# Altium schematic sheet SENSE.SchDoc
size Letter; SheetNumber: 2; SheetTotal: 2
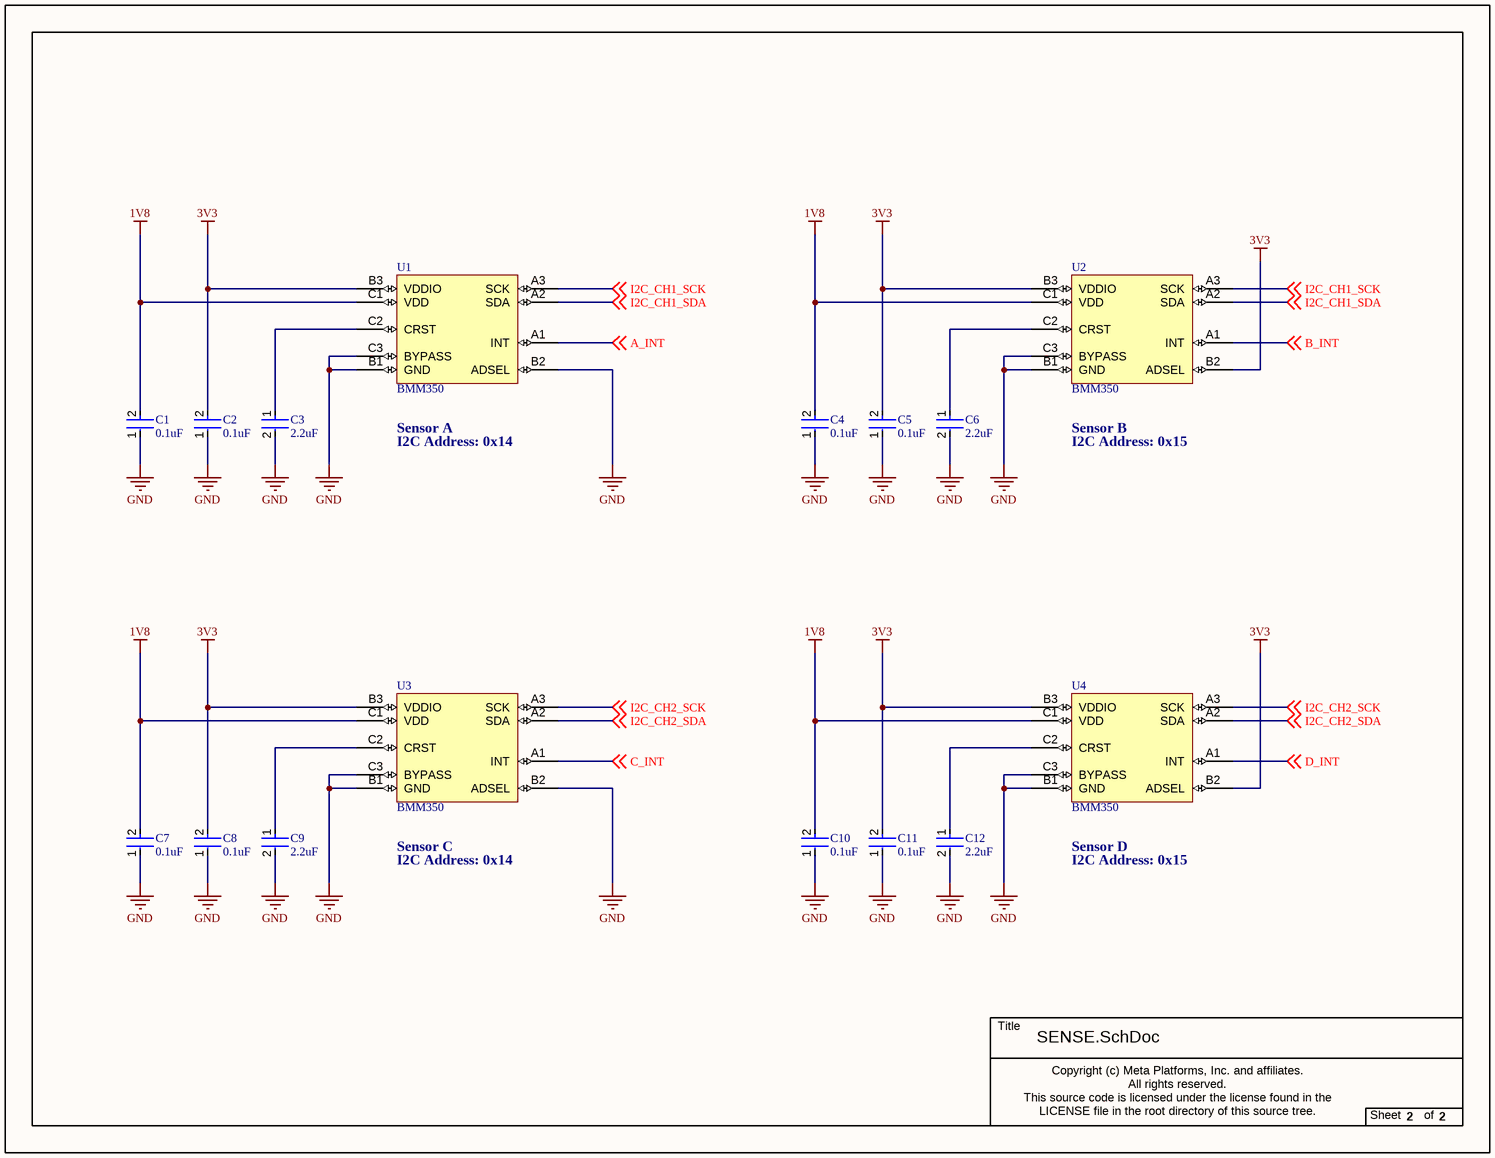
[diagram p0: SENSE.SchDoc]

## Parts
C1  0.1uF  [FP-GRM15-MFG]
C2  0.1uF  [FP-GRM15-MFG]
C3  2.2uF  [FP-C1005-050-0_15-0_1-MFG]
C4  0.1uF  [FP-GRM15-MFG]
C5  0.1uF  [FP-GRM15-MFG]
C6  2.2uF  [FP-C1005-050-0_15-0_1-MFG]
C7  0.1uF  [FP-GRM15-MFG]
C8  0.1uF  [FP-GRM15-MFG]
C9  2.2uF  [FP-C1005-050-0_15-0_1-MFG]
C10  0.1uF  [FP-GRM15-MFG]
C11  0.1uF  [FP-GRM15-MFG]
C12  2.2uF  [FP-C1005-050-0_15-0_1-MFG]
U1  BMM350  [BMM350]
U2  BMM350  [BMM350]
U3  BMM350  [BMM350]
U4  BMM350  [BMM350]

## Nets
1V8: C1.2 C4.2 C7.2 C10.2 U1.C1(VDD) U2.C1(VDD) U3.C1(VDD) U4.C1(VDD)
3V3: C2.2 C5.2 C8.2 C11.2 U1.B3(VDDIO) U2.B2(ADSEL) U2.B3(VDDIO) U3.B3(VDDIO) U4.B2(ADSEL) U4.B3(VDDIO)
GND: C1.1 C2.1 C3.2 C4.1 C5.1 C6.2 C7.1 C8.1 C9.2 C10.1 C11.1 C12.2 U1.B1(GND) U1.B2(ADSEL) U1.C3(BYPASS) U2.B1(GND) U2.C3(BYPASS) U3.B1(GND) U3.B2(ADSEL) U3.C3(BYPASS) U4.B1(GND) U4.C3(BYPASS)
A_INT: U1.A1(INT) ; off-sheet A_INT
B_INT: U2.A1(INT) ; off-sheet B_INT
C_INT: U3.A1(INT) ; off-sheet C_INT
D_INT: U4.A1(INT) ; off-sheet D_INT
I2C_CH1_SCK: U1.A3(SCK) U2.A3(SCK) ; off-sheet I2C_CH1_SCK
I2C_CH1_SDA: U1.A2(SDA) U2.A2(SDA) ; off-sheet I2C_CH1_SDA
I2C_CH2_SCK: U3.A3(SCK) U4.A3(SCK) ; off-sheet I2C_CH2_SCK
I2C_CH2_SDA: U3.A2(SDA) U4.A2(SDA) ; off-sheet I2C_CH2_SDA
NetC3_1: C3.1 U1.C2(CRST)
NetC6_1: C6.1 U2.C2(CRST)
NetC9_1: C9.1 U3.C2(CRST)
NetC12_1: C12.1 U4.C2(CRST)

## Notes on the sheet
- (near U1) Sensor A
- (near U2) Sensor B
- I2C Address: 0x14
- I2C Address: 0x15
- (near U3) Sensor C
- (near U4) Sensor D
- Title
- Copyright (c) Meta Platforms, Inc. and affiliates.
  All rights reserved.
  This source code is licensed under the license found in the
  LICENSE file in the root directory of this source tree.
- Sheet
- of

## Library data of the parts
C1 C2 C4 C5 C7 C8 C10 C11 = CMP-2100-03641-2: CAP CER 0.1UF 16V X7R 0402; Manufacturer Part Number: GRM155R71C104KA88D; Manufacturer: Murata; Standoff Height: 0mm; Tolerance: 10%; Voltage Rating: 16Vdc; Material: Ceramic; Capacitance: 0.10μF; Value: 0.10μF; RoHS: TRUE; Temperature Characteristic: X7R; Octopart: https://octopart.com/grm155r71c104ka88d-murata-196880; Digikey Description: CAP CER 0.1UF 16V X7R 0402; Device Class L3: Ceramic Capacitors; Height: 0.55mm; ComponentLink2Description: Datasheet; Temperature Range Low: -55°C; Ipc Land Pattern Name: CAPC10050X219; ComponentLink2URL: https://search.murata.co.jp/Ceramy/image/img/A01X/G101/ENG/GRM155R71H471KA01-01A.pdf; Device Class L1: Passive Components; Lead Free: yes; Category: Cap; Package: GRM15; Temperature: -55°C to +125°C; Device Class L2: Capacitors; Temperature Range High: +125°C; Mouser Description: 0402 0.1 uF 16V ±10 % Tolerance X7R SMT Multilayer Ceramic Capacitor
C3 C6 C9 C12 = CMP-08246-004344-1: CAP CER 2.2UF 10V X7S 0402; Dielectric Material: Ceramic; Tolerance: 10%; Mount: Surface Mount; Height: 0.5mm; Package Quantity: 1; Depth: 0.5mm; RoHS Compliant: Yes; Length: 1mm; Thickness: 0.022inch; Packaging: Tape and Reel; Capacitance: 2.2uF; Case Code (Imperial): 0402; Resistor Type: Ceramic; Dielectric: X7S; Case/Package: 0402; Min Operating Temperature: -55°C; Voltage Rating: 10V; Series: C; Weight: 2.3E-05oz; Width: 0.02inch; Voltage Rating (DC): 10V; Case Code (Metric): 1005; Max Operating Temperature: 125°C; Termination: SMD/SMT; Lead Free: Lead Free